# EAGLE design PET_Diag_UP (EAGLE 9.5.2)
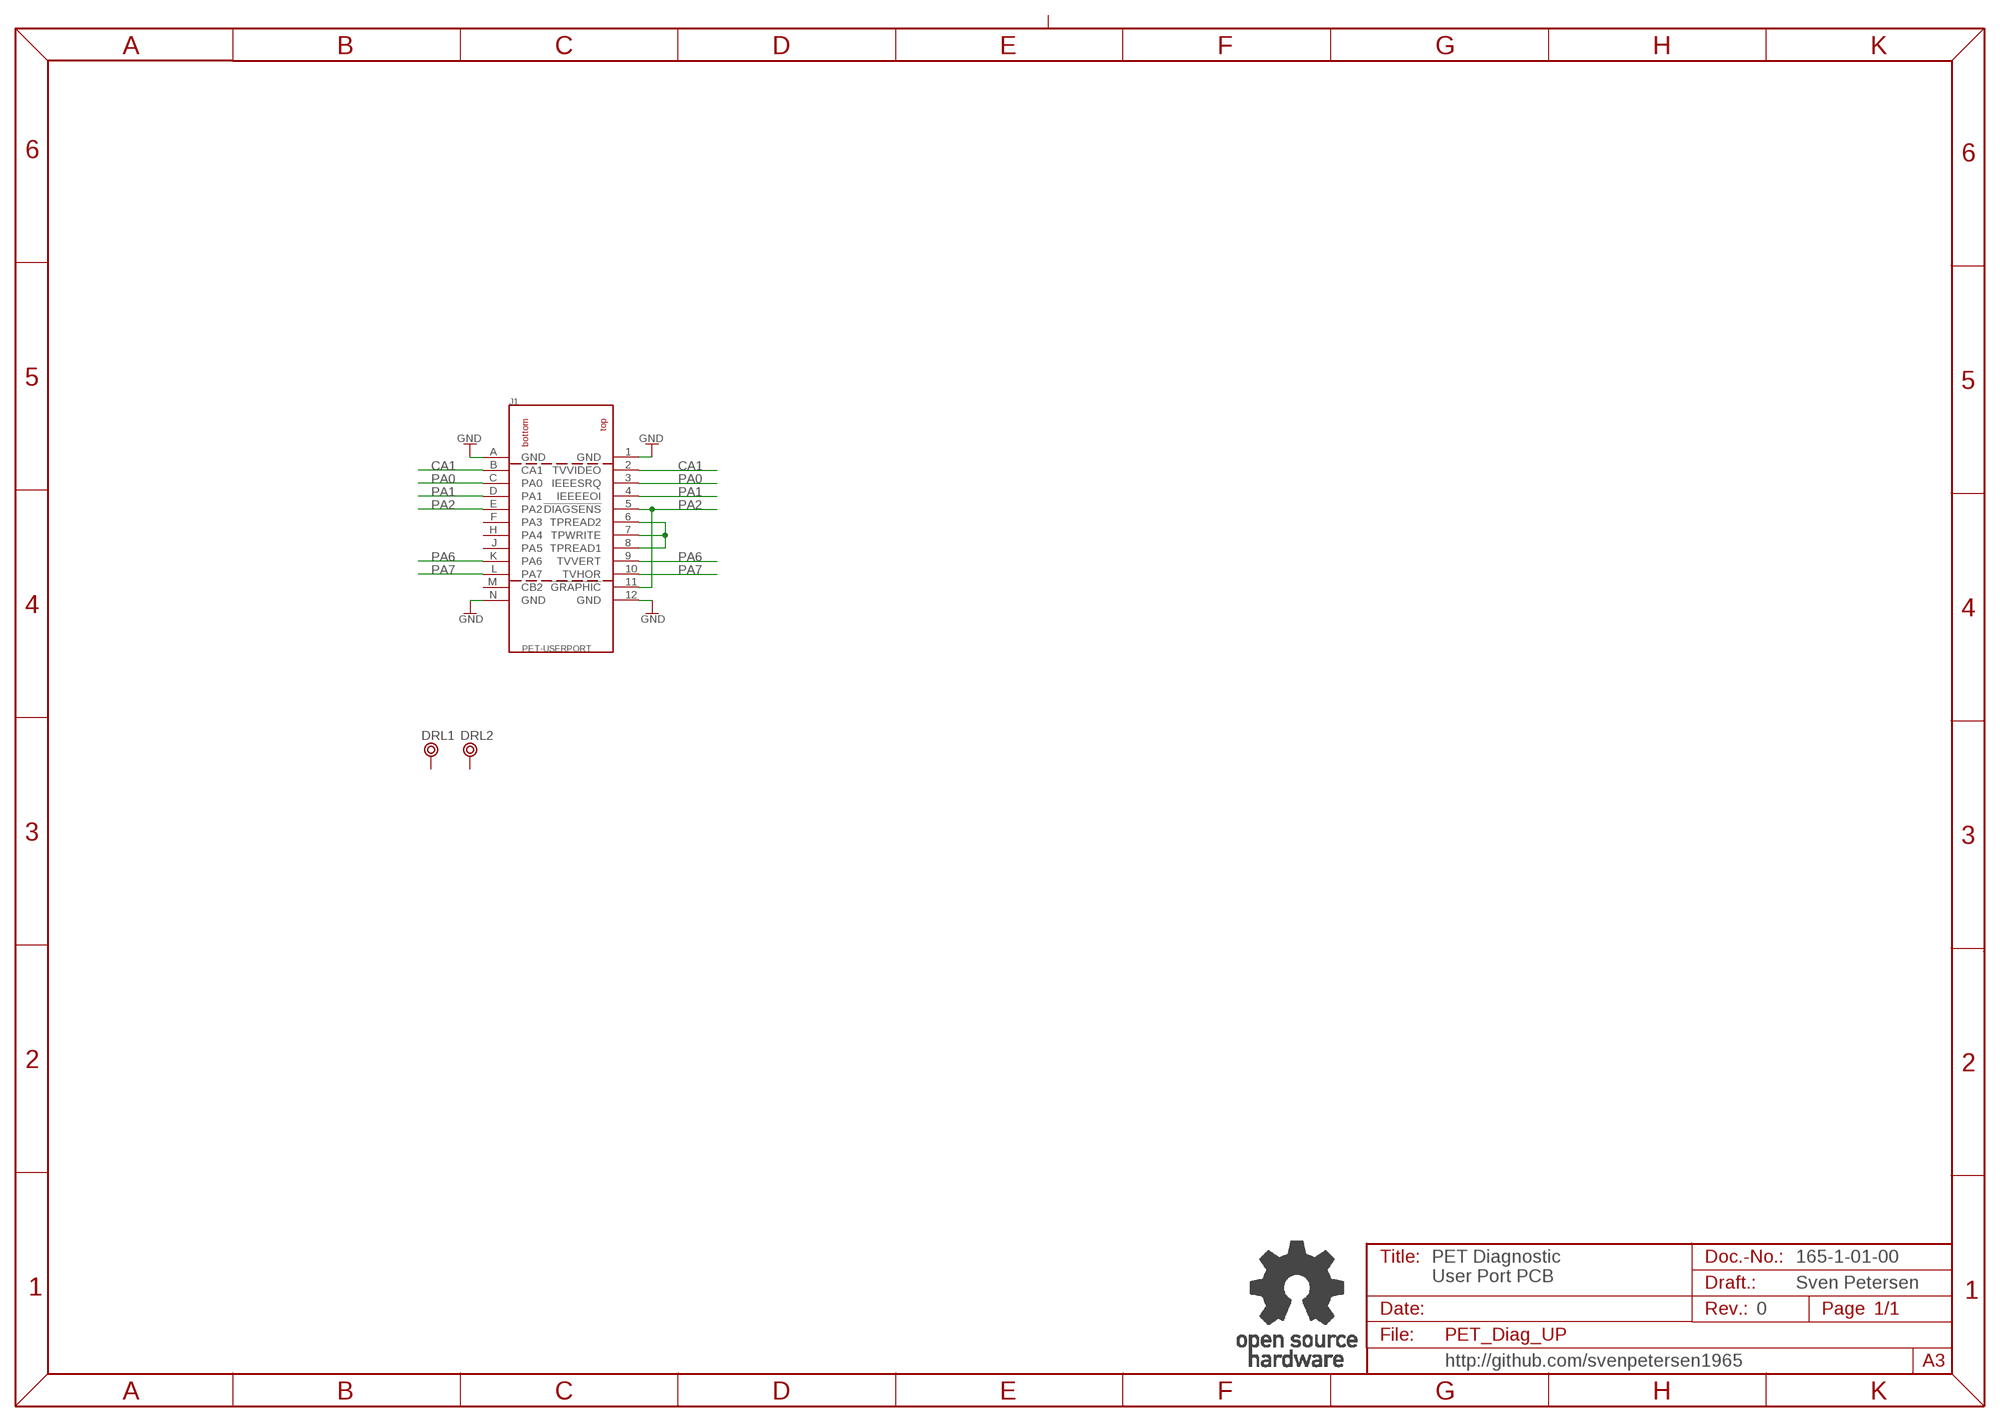
[diagram p0: schematic, sheet 1]

## Parts
DRL1  BOHR3,5  [BOHR3,5]
DRL2  BOHR3,5  [BOHR3,5]
J1  PET-USERPORT  [USERPORT]
U$13  OPEN_SOURCE_HW  [OPENHW]

## Nets
CA1: J1.2(TVVIDEO) J1.B(CA1)
GND: J1.1(GND) J1.12(GND) J1.A(GND) J1.N(GND)
N$2: J1.6(TPREAD2) J1.7(TPWRITE) J1.8(TPREAD1)
PA0: J1.3(IEEESRQ) J1.C(PA0)
PA1: J1.4(IEEEEOI) J1.D(PA1)
PA2: J1.5(!DIAGSENS) J1.11(!GRAPHIC) J1.E(PA2)
PA6: J1.9(TVVERT) J1.K(PA6)
PA7: J1.10(TVHOR) J1.L(PA7)
Unconnected: DRL1.P$1 DRL2.P$1 J1.F(PA3) J1.H(PA4) J1.J(PA5) J1.M(CB2)

## Notes on the sheet
- 165-1-01-00
- PET Diagnostic
  User Port PCB
- Sven Petersen
- 0
- http://github.com/svenpetersen1965

## Library data of the parts
DRL1 DRL2 = Mech_Bohr:BOHR3,5
J1 = Commodore:PET-USERPORT
U$13 = Logo:OPEN_SOURCE_HW

## Board
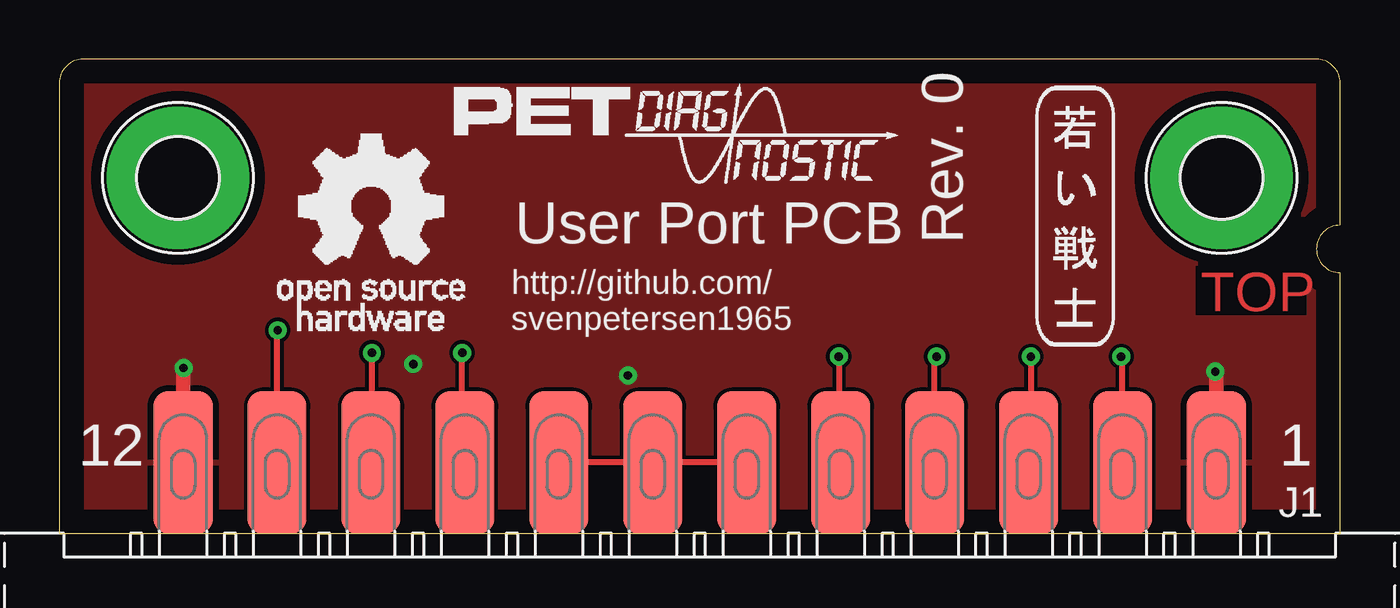
[diagram p1: board, top side]
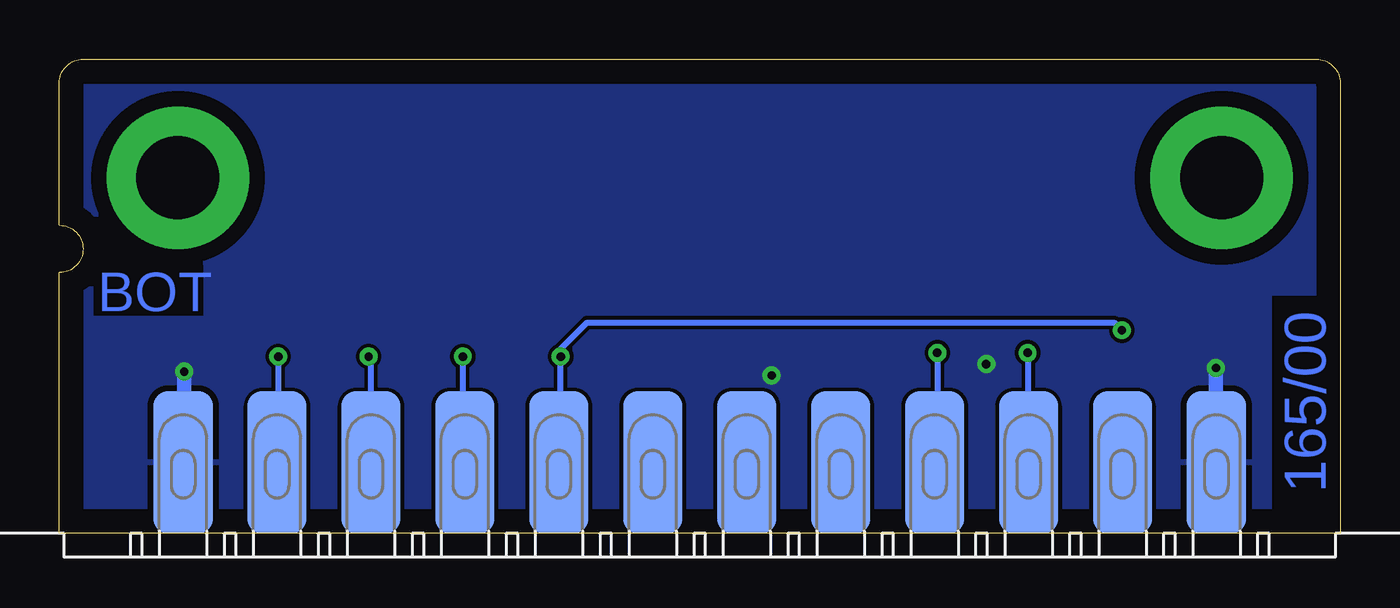
[diagram p2: board, bottom side, seen from below]

Size 54 x 20 mm. Coordinates in mm from the lower left corner, seen from the top.
Outline: 0,0 54,0 54,11 arc-180 54,13 54,19 arc90 53,20 1,20 arc90 0,19 0,0
Copper layers (1*16): Top 0.035mm / dielectric 1.5mm / Bottom 0.035mm
Design rules "default *": minimum track width 6mil, minimum drill 0.35mm, track to track 6mil, track to pad 6mil, pad to pad 6mil, via to via 6mil, smd to smd 6mil, copper to edge 40mil, drill to drill 6mil, minimum pad ring 10mil, minimum via ring 8mil, stop-mask expansion 4mil, vias tented up to drill 25mil, thermal gap 10mil
bRestrict: 2 lines

### Footprints (pad centres in the part's own frame; a part is rotated, then mirrored left to right if it is on the bottom)
BOHR3,5 = drill 3.5 pad 6: P$1 0,0
USERPORT = smd 2.5 x 6: 1 -21.78,-3; 2 -17.82,-3; 3 -13.86,-3; 4 -9.9,-3; 5 -5.94,-3; 6 -1.98,-3; 7 1.98,-3; 8 5.94,-3; 9 9.9,-3; 10 13.86,-3; 11 17.82,-3; 12 21.78,-3 | smd 2.5 x 6 bottom: A -21.78,-3; B -17.82,-3; C -13.86,-3; D -9.9,-3; E -5.94,-3; F -1.98,-3; H 1.98,-3; J 5.94,-3; K 9.9,-3; L 13.86,-3; M 17.82,-3; N 21.78,-3

### Placement (x,y rotation side)
DRL1  5,15 0 top
DRL2  49,15 0 top
J1  27,0 180 top
U$6  [DIAG_SMALL]  23.81,14.76 0 top
U$7  [PET_SMALL]  16.66,16.82 0 top
U$8  [2LAYER]  48.1,9.37 0 top
U$9  [PCB-TITLE/]  0.16,27.94 0 top  (outside the outline)
U$10  [SVEN_TAG]  42.86,13.49 0 top
U$13  9.21,8.57 0 top

### Tracks (layer width: path | path; a pad name or v marks a point on that pad's centre or on a via)
CA1  (via drill 0.35)
  Top 0.254: J1.2 44.82,7.41 v44.77,7.46
  Bottom 0.254: v44.77,7.46 44.77,3.05 J1.2
GND  (via drill 0.35)
  Top 0.61: J1.12 5.22,6.97 v5.24,6.99 | J1.A 48.78,6.78 v48.74,6.83
  Bottom 0.61: v5.24,6.99 5.24,3.02 J1.12 | v48.74,6.83 48.74,3.04 J1.A
  other vias: 23.97,6.67 14.92,7.14
  pour Top: 0.79,19.05 53.02,19.05 53.02,0.79 0.79,0.79
  pour Bottom: 0.79,19.05 53.02,19.05 53.02,0.79 0.79,0.79
N$2
  Top 0.254: J1.6 J1.7 J1.8
PA0  (via drill 0.35)
  Top 0.254: v40.96,7.46 40.96,3.1 J1.3
  Bottom 0.254: J1.3 40.86,7.36 v40.96,7.46
PA1  (via drill 0.35)
  Top 0.254: J1.4 36.9,7.37 v36.99,7.46
  Bottom 0.254: v36.99,7.46 36.99,3.09 J1.4
PA2  (via drill 0.35)
  Top 0.254: v32.86,7.46 32.86,3.08 J1.5 | J1.11 9.18,8.54 v9.21,8.57
  Bottom 0.254: J1.5 32.86,3.08 v32.86,7.46 32.86,7.78 31.75,8.89 9.53,8.89 v9.21,8.57
PA6  (via drill 0.35)
  Top 0.254: J1.9 16.99,3.11 v16.99,7.62
  Bottom 0.254: v16.99,7.62 16.99,3.11 J1.9
PA7  (via drill 0.35)
  Top 0.254: v13.18,7.62 13.18,3.04 J1.10
  Bottom 0.254: J1.10 13.14,7.58 v13.18,7.62

### Text on the board
Bottom: 165/00
tPlace: User Port PCB | Rev. 0 | http://github.com/ / svenpetersen1965 | 12 | 1
Document: 165-2-01-00 | Sven Petersen / 2020 | 35µm | 2 | 0